# Altium schematic sheet Fleet-Monitor-Accelerometer.SchDoc: Fleet Monitor
size A4; Subtitle: Accelerometer; DocumentNumber: 8; Revision: V1.0; SheetNumber: 8; SheetTotal: 8; Author: Florian Baumgartner & Luca Jost
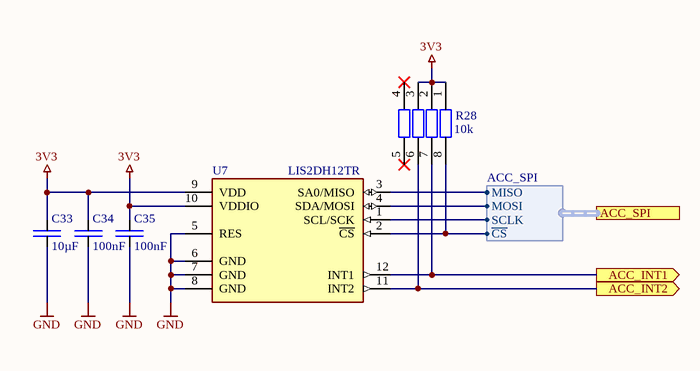
[diagram p0: Fleet-Monitor-Accelerometer.SchDoc]

## Parts
C33  10µF  [SMD Keramikkondensator 0603]
C34  100nF  [SMD Keramikkondensator 0603]
C35  100nF  [SMD Keramikkondensator 0603]
R28  10k  [SMD Widerstand Array 4-Fach 0603]
U7  LIS2DH12TR  [SMD IC LGA-12]

## Ports
ACC_INT1 (out), ACC_INT2 (out), ACC_SPI (harness ACC_SPI)

## Harnesses
ACC_SPI: SCLK, MOSI, MISO, ~{CS}

## Nets
3V3: C33.2 C34.2 C35.2 R28.1 R28.2 R28.3 U7.9(VDD) U7.10(VDDIO)
GND: C33.1 C34.1 C35.1 U7.5(RES) U7.6(GND) U7.7(GND) U7.8(GND)
ACC_INT1: R28.7 U7.12(INT1) ; port ACC_INT1
ACC_INT2: R28.6 U7.11(INT2) ; port ACC_INT2
NetR28_8: R28.8 U7.2(~{CS}) ; port ACC_SPI.~{CS}
NetU7_1: U7.1(SCL/SCK) ; port ACC_SPI.SCLK
NetU7_3: U7.3(SA0/MISO) ; port ACC_SPI.MISO
NetU7_4: U7.4(SDA/MOSI) ; port ACC_SPI.MOSI

Not connected (* = marked no-connect by the designer): R28 4* 5*

## Notes on the sheet
- Title
- Author:
- Subtitle
- Date:
- Rev:
- File:
- Sheet
- of

## Library data of the parts
C33 = E6 - 10uF: SMD Ceramic Capacitor E6; Component Value: 10µF 10V; Component Description: Multilayer Ceramic Capacitors MLCC; ComponentLink1Description: Datasheet; ComponentLink1URL: https://datasheet.lcsc.com/lcsc/1810191219_Samsung-Electro-Mechanics-CL10A106KP8NNNC_C19702.pdf; Digikey: 587-3258-1-ND; Farnell: 2113070; JLC-Parts: C19702; Mouser: 963-LMK107BBJ106MALT; Unit Price: 0.01
C34 C35 = E6 - 100nF: SMD Ceramic Capacitor E6; Component Value: 100nF 50V; Component Description: Multilayer Ceramic Capacitors MLCC; ComponentLink1Description: Datasheet; ComponentLink1URL: https://datasheet.lcsc.com/lcsc/1809301912_YAGEO-CC0603KRX7R9BB104_C14663.pdf; Digikey: 445-6899-1-ND; Farnell: 2210822; JLC-Parts: C14663; Mouser: 810-CGA2B3X7R1H104K; Unit Price: 0.01
R28 = R-Array Single Quad E24 - 10k: Isolated Resistor Array; Component Value: 10k (4x, 50V, 62.5mW, 5%); ComponentLink1Description: Datasheet; ComponentLink1URL: https://datasheet.lcsc.com/lcsc/1810191515_UNI-ROYAL-Uniroyal-Elec-4D03WGJ0103T5E_C29718.pdf; Digikey: Y4103CT-ND; Farnell: 2060167; JLC-Parts: C29718; Mouser: 667-EXB-V8V103JV; Unit Price: 0.01; Component Description: Isolated Resistor Array
U7 = LIS2DH12TR: Accelerometer X, Y, Z Axis ±2g, 4g, 8g, 16g 0.5Hz ~ 672Hz 12-LGA (2x2); Component Description: High-Performance 3-Xxis Accelerometer; ComponentLink1Description: Datasheet; ComponentLink1URL: https://www.st.com/content/ccc/resource/technical/document/datasheet/12/c0/5c/36/b9/58/46/f2/DM00091513.pdf/files/DM00091513.pdf/jcr:content/translations/en.DM00091513.pdf; Digikey: 497-14851-2-ND; Component Value: LIS2DH12TR; JLC-Parts: C110926; Mouser: 511-LIS2DH12TR; Unit Price: 0.87